# EAGLE design schematic (EAGLE 8.3.0)
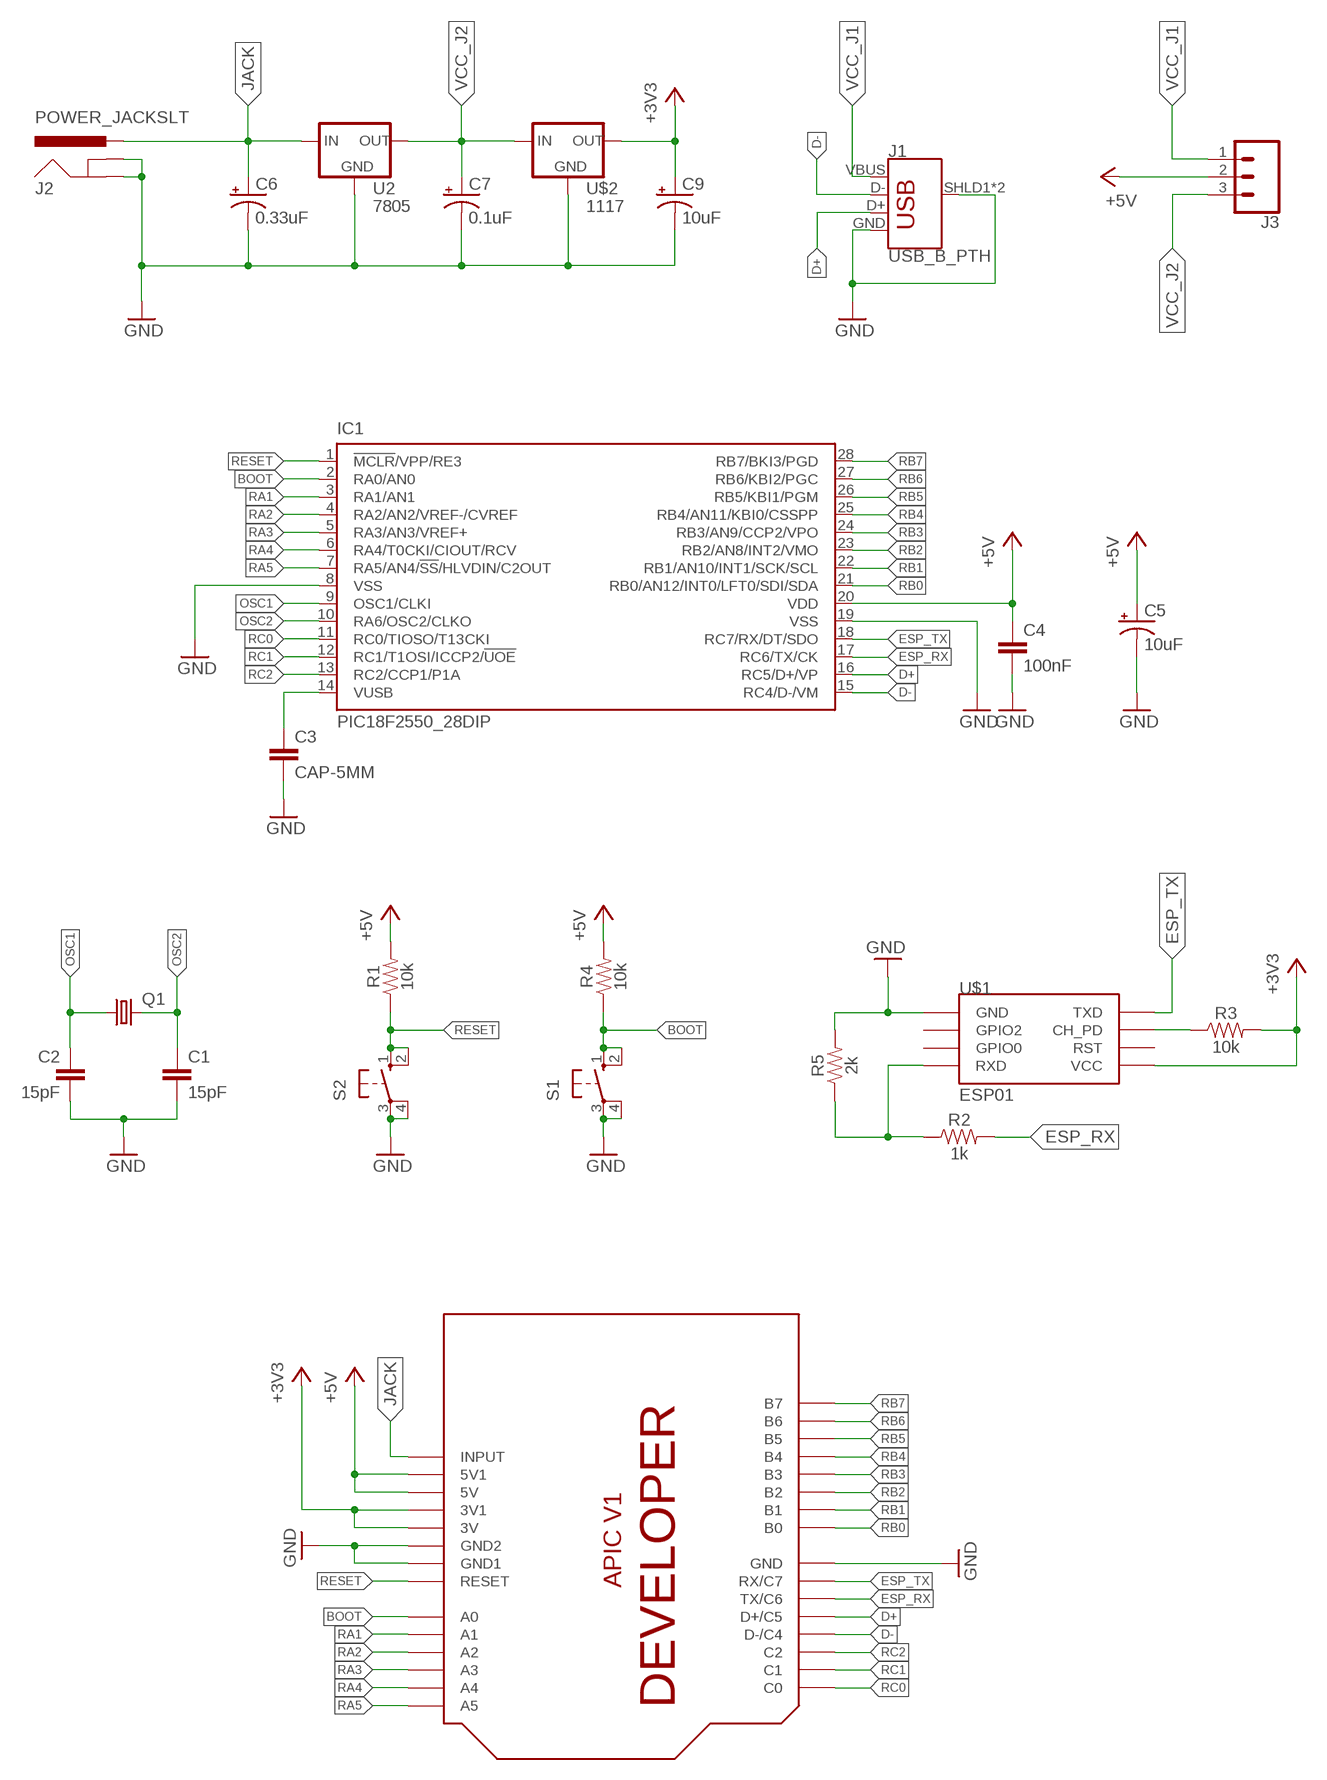
[diagram p0: schematic, sheet 1]

## Parts
C1  15pF  0.1UF-KIT-EZ-50V-20%  [CAP-PTH-SMALL-KIT]
C2  15pF  0.1UF-KIT-EZ-50V-20%  [CAP-PTH-SMALL-KIT]
C3  CAP-5MM  [CAP-PTH-5MM]
C4  100nF  0.1UF-KIT-EZ-50V-20%  [CAP-PTH-SMALL-KIT]
C5  10uF  10UF-POLAR-RADIAL-2.5MM-25V-20%  [CPOL-RADIAL-2.5MM-5MM]
C6  0.33uF  10UF-POLAR-RADIAL-2.5MM-25V-20%  [CPOL-RADIAL-2.5MM-5MM]
C7  0.1uF  10UF-POLAR-RADIAL-2.5MM-25V-20%  [CPOL-RADIAL-2.5MM-5MM]
C9  10uF  10UF-POLAR-RADIAL-2.5MM-25V-20%  [CPOL-RADIAL-2.5MM-5MM]
IC1  PIC18F2550_28DIP  [DIL28-3]
J1  USB_B_PTH  [USB-B-PTH]
J2  POWER_JACKSLT  [POWER_JACK_SLOT]
J3  CONN_03LOCK_LONGPADS  [1X03_LOCK_LONGPADS]
Q1  CRYSTAL  [HC49U70]
R1  10k  10KOHM-HORIZ-1/4W-1%  [AXIAL-0.3]
R2  1k  10KOHM-HORIZ-1/4W-1%  [AXIAL-0.3]
R3  10k  10KOHM-HORIZ-1/4W-1%  [AXIAL-0.3]
R4  10k  10KOHM-HORIZ-1/4W-1%  [AXIAL-0.3]
R5  2k  10KOHM-HORIZ-1/4W-1%  [AXIAL-0.3]
S1  10-XX  [B3F-10XX]
S2  10-XX  [B3F-10XX]
U1  APIC-BPLACE  [APIC]
U2  7805  V_REG_78XXSIDE  [78XXL]
U$1  ESP01  [ESP01]
U$2  1117  V_REG_LD1117VXX  [78XXL]

## Nets
+3V3: C9.1(+) R3.P$2 U1.3V U1.3V1 U$1.VCC U$2.GND(OUT)
+5V: C4.1 C5.1(+) IC1.20(VDD) J3.2 R1.P$2 R4.P$2 U1.5V U1.5V1
BOOT: IC1.2(RA0/AN0) R4.P$1 S1.1(S) S1.2(S1) U1.A0
D+: IC1.16(RC5/D+/VP) J1.D+ U1.C5(D+/C5)
D-: IC1.15(RC4/D-/VM) J1.D- U1.C4(D-/C4)
ESP_RX: IC1.17(RC6/TX/CK) R2.P$2 U1.C6(TX/C6)
ESP_TX: IC1.18(RC7/RX/DT/SDO) U1.C7(RX/C7) U$1.TX(TXD)
GND: C1.2 C2.2 C3.2 C4.2 C5.2(-) C6.2(-) C7.2(-) C9.2(-) IC1.8(VSS) IC1.19(VSS) J1.GND J1.SHLD1(SHIELD) J1.SHLD2(SHIELD) J2.GND@1(GNDBREAK) J2.GND@2(GND) R5.P$2 S1.3(P) S1.4(P1) S2.3(P) S2.4(P1) U1.GND U1.GND1 U1.GND2 U2.GND U$1.GND U$2.IN(GND)
JACK: C6.1(+) J2.PWR U1.INPUT U2.IN
N$1: R3.P$1 U$1.CH_PD
N$6: R2.P$1 R5.P$1 U$1.RX(RXD)
N$11: C3.1 IC1.14(VUSB)
OSC1: C2.1 IC1.9(OSC1/CLKI) Q1.1
OSC2: C1.1 IC1.10(RA6/OSC2/CLKO) Q1.2
RA1: IC1.3(RA1/AN1) U1.A1
RA2: IC1.4(RA2/AN2/VREF-/CVREF) U1.A2
RA3: IC1.5(RA3/AN3/VREF+) U1.A3
RA4: IC1.6(RA4/T0CKI/CIOUT/RCV) U1.A4
RA5: IC1.7(RA5/AN4/!SS!/HLVDIN/C2OUT) U1.A5
RB0: IC1.21(RB0/AN12/INT0/LFT0/SDI/SDA) U1.B0
RB1: IC1.22(RB1/AN10/INT1/SCK/SCL) U1.B1
RB2: IC1.23(RB2/AN8/INT2/VMO) U1.B2
RB3: IC1.24(RB3/AN9/CCP2/VPO) U1.B3
RB4: IC1.25(RB4/AN11/KBI0/CSSPP) U1.B4
RB5: IC1.26(RB5/KBI1/PGM) U1.B5
RB6: IC1.27(RB6/KBI2/PGC) U1.B6
RB7: IC1.28(RB7/BKI3/PGD) U1.B7
RC0: IC1.11(RC0/TIOSO/T13CKI) U1.C0
RC1: IC1.12(RC1/T1OSI/ICCP2/!UOE) U1.C1
RC2: IC1.13(RC2/CCP1/P1A) U1.C2
RESET: IC1.1(!MCLR!/VPP/RE3) R1.P$1 S2.1(S) S2.2(S1) U1.RESET
VCC_J1: J1.VBUS J3.1
VCC_J2: C7.1(+) J3.3 U2.OUT U$2.OUT(IN)
Unconnected: U$1.GPIO0 U$1.GPIO2 U$1.RST

## Library data of the parts
C1 C2 C4 = SparkFun-Capacitors:0.1UF: 0.1µF ceramic capacitors A capacitor is a passive two-terminal electrical component used to store electrical energy temporarily in an electric field.; PROD_ID: CAP-08370; VALUE: 0.1uF
C3 = 1AugustoLib:CAP-5MM
C5 C9 = SparkFun-Capacitors:10UF-POLAR: 10.0µF polarized capacitors A capacitor is a passive two-terminal electrical component used to store electrical energy temporarily in an electric field.; PROD_ID: CAP-08440
C6 C7 = SparkFun-Capacitors:10UF-POLAR: 10.0µF polarized capacitors A capacitor is a passive two-terminal electrical component used to store electrical energy temporarily in an electric field.; PROD_ID: CAP-08440; VALUE: 10uF
IC1 = microchip:PIC18F2*_28: USB Microcontrollers with nanoWatt Technology High-Performance, Enhanced Flash, 28/40/44-Pin, Source: http://ww1.microchip.com/downloads/en/devicedoc/39632c.pdf; MF: MICROCHIP; MPN: PIC18F2550-I/SP; OC_FARNELL: 1523822; OC_NEWARK: 80K6054
J1 = 1AugustoLib:USB_B: USB Type B Connector SparkFun Products: SparkFun Stepoko <https://www.sparkfun.com/products/13899> PTH; PROD_ID: CONN-08278; SF_ID: PRT-00139
J2 = SparkFun-Connectors:POWER_JACK: Power Jack Connector This is the standard 5.5mm barrel jack for power. The PTH is the most common, proven, reliable, footprint. The Slot footprint only works if the mill layer is transmitted to the PCB fab house so be warned. Here are the connectors we sell at SparkFun: DC Barrel Power Jack/Connector <https://www.sparkfun.com/products/119> (PRT-00119) DC Barrel Power Jack/Connector (SMD) <https://www.sparkfun.com/products/12748> (PRT-12748) DC Barrel Jack Adapter - Breadboard Compatible <https://www.sparkfun.com/products/10811> (PRT-10811) It is used on this SparkFun product (and many, many others): SparkFun RedBoard - Programmed with Arduino <https://www.sparkfun.com/products/12757> (DEV-12757) Also, if you need a mating power supply or connector, please check these out: Wall Adapter Power Supply - 9VDC 650mA <https://www.sparkfun.com/products/298> (TOL-00298) DC Barrel Jack Adapter - Male <https://www.sparkfun.com/products/10287> (PRT-10287); PROD_ID: PRT-00119
J3 = SparkFun-Connectors:CONN_03: Multi connection point. Often used as Generic Header-pin footprint for 0.1 inch spaced/style header connections On any of the 0.1 inch spaced packages, you can populate with these: Break Away Headers - Straight <https://www.sparkfun.com/products/116> (PRT-00116) Break Away Male Headers - Right Angle <https://www.sparkfun.com/products/553> (PRT-00553) Female Headers <https://www.sparkfun.com/products/115> (PRT-00115) Break Away Headers - Machine Pin <https://www.sparkfun.com/products/117> (PRT-00117) Break Away Female Headers - Swiss Machine Pin <https://www.sparkfun.com/products/743> (PRT-00743) Stackable Header - 3 Pin (Female, 0.1") <https://www.sparkfun.com/products/13875> (PRT-13875) For SCREWTERMINALS and SPRING TERMINALS visit here: Screw Terimnals on SparkFun.com <https://www.sparkfun.com/search/results?term=Screw+Terminals> (5mm/3.5mm/2.54mm spacing) This device is also useful as a general connection point to wire up your design to another part of your project. Our various solder wires solder well into these plated through hole pads. Hook-Up Wire - Assortment (Stranded, 22 AWG) <https://www.sparkfun.com/products/11375> (PRT-11375) Hook-Up Wire - Assortment (Solid Core, 22 AWG) <https://www.sparkfun.com/products/11367> (PRT-11367) View the entire wire category on our website here <https://www.sparkfun.com/categories/141> Special notes: Molex polarized connector foot print use with SKU : PRT-08232 with associated crimp pins and housings.
Q1 = 1AugustoLib:CRYSTAL
R1 R3 R4 = SparkFun-Resistors:10KOHM: 10kΩ resistor A resistor is a passive two-terminal electrical component that implements electrical resistance as a circuit element. Resistors act to reduce current flow, and, at the same time, act to lower voltage levels within circuits. - Wikipedia; PROD_ID: RES-12183
R2 R5 = SparkFun-Resistors:10KOHM: 10kΩ resistor A resistor is a passive two-terminal electrical component that implements electrical resistance as a circuit element. Resistors act to reduce current flow, and, at the same time, act to lower voltage levels within circuits. - Wikipedia; PROD_ID: RES-12183; VALUE: 10k
S1 S2 = switch-omron:10-XX: OMRON SWITCH; MPN: B3F-1000; OC_FARNELL: 176432; OC_NEWARK: 36M3542
U1 = 1AugustoLib:APIC: This is a new object for the new Arduino R3 - with extra pins that you may want to use (such as IOref, and duplicated A4/A5
U2 = 1AugustoLib:V_REG_78XX: Voltage Regulator Standard 78xx regulator. IGO (Input Ground Output). Spark Fun Electronics SKU : COM-00107
U$1 = 1AugustoLib:ESP01: ESP8266 Wifi module 01
U$2 = 1AugustoLib:V_REG_LD1117VXX: LD1117VXX voltage regulator. We carry the 3.3V version (COM-00526) in TO-220 package.

## Board
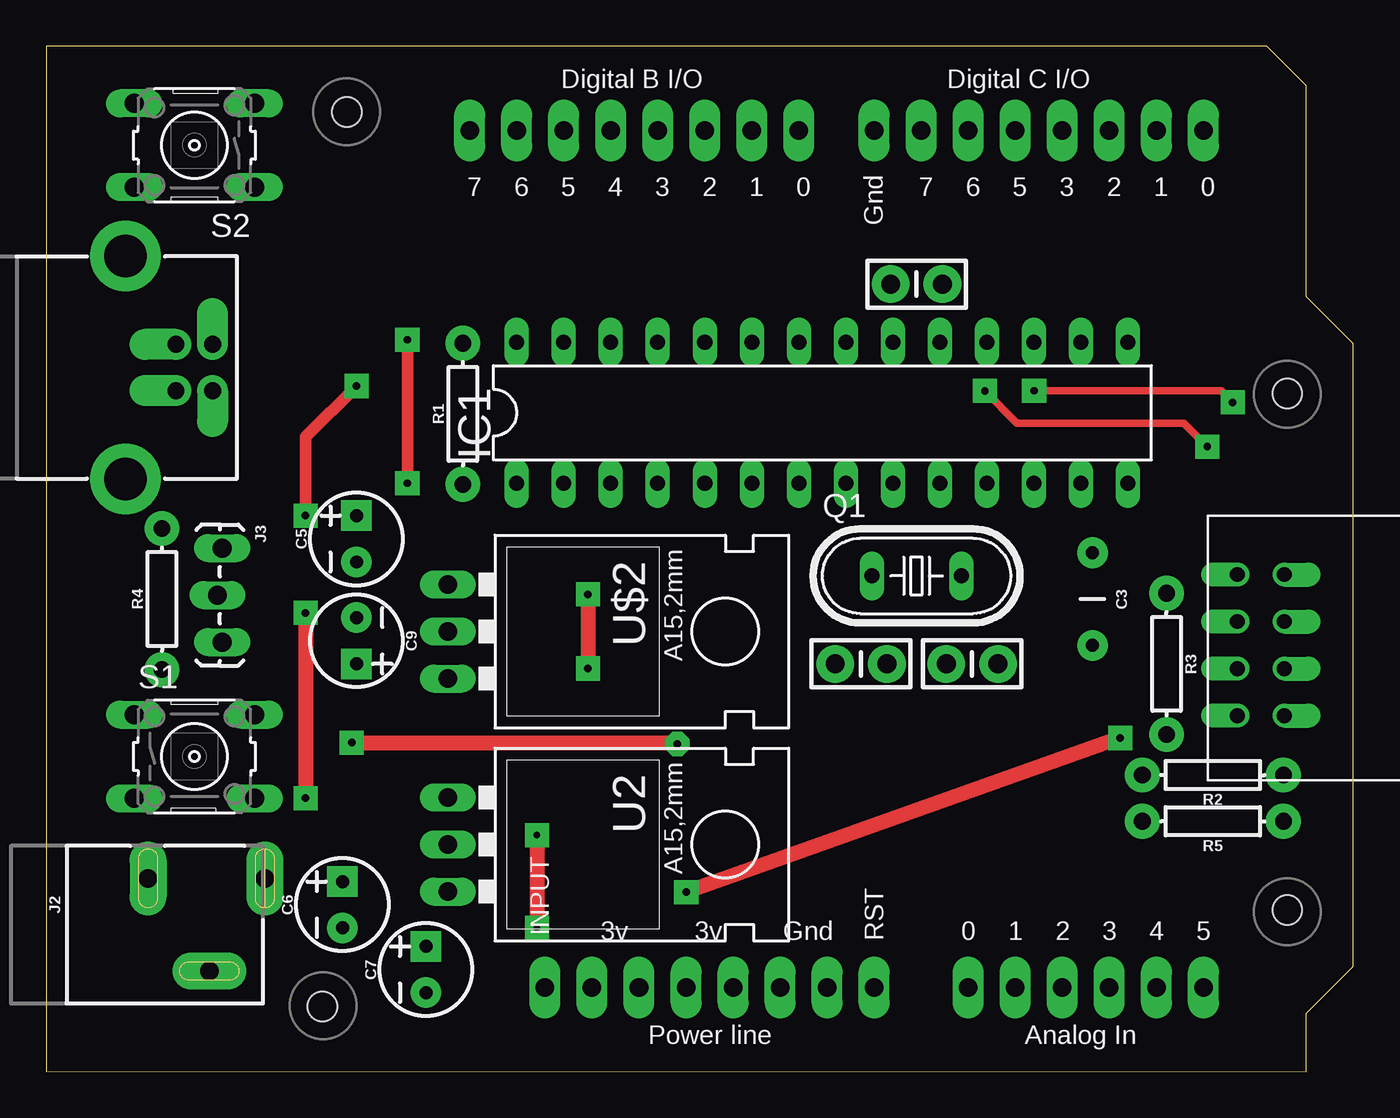
[diagram p1: board, top side]
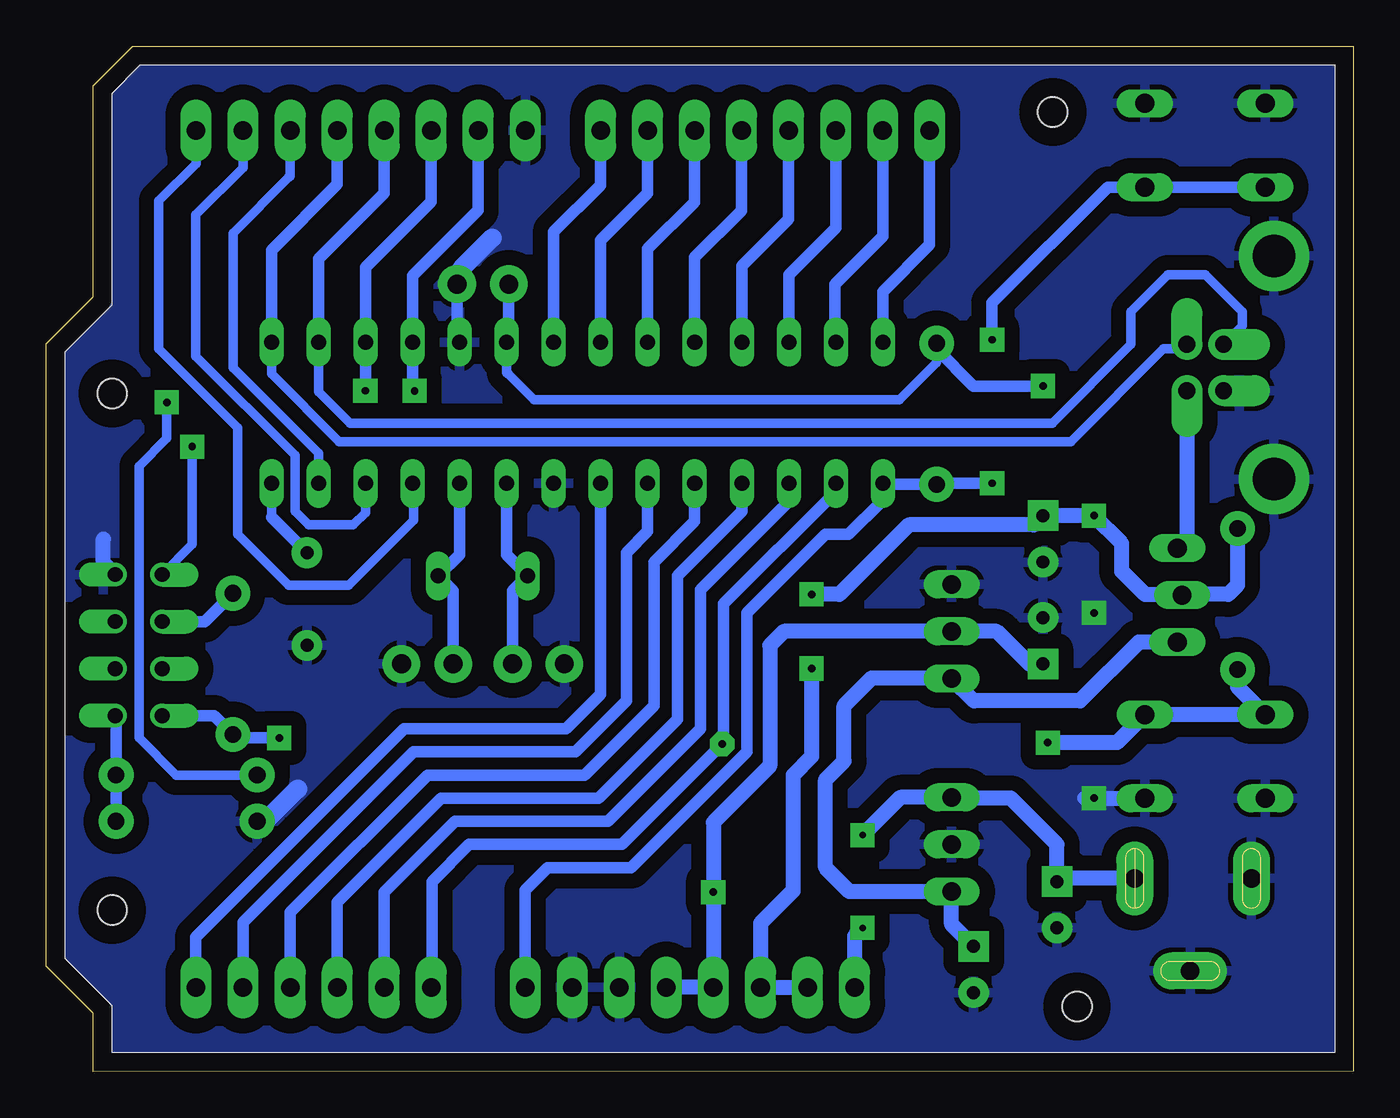
[diagram p2: board, bottom side, seen from below]

Size 70.58 x 55.35 mm. Coordinates in mm from the lower left corner, seen from the top.
Outline: 0,0.01 68.05,0 68.05,3.16 70.58,5.69 70.58,39.29 68.04,41.83 68.04,53.23 65.92,55.35 0,55.35 0,0.01
Copper layers (1*16): Top 0.035mm / dielectric 1.5mm / Bottom 0.035mm
Design rules "default": minimum track width 6mil, minimum drill 0.35mm, track to track 6mil, track to pad 6mil, pad to pad 6mil, via to via 6mil, smd to smd 6mil, copper to edge 40mil, drill to drill 6mil, minimum pad ring 10mil, minimum via ring 8mil, stop-mask expansion 4mil, vias tented up to drill 0mil, thermal gap 10mil
Holes 1.6 mm at 16.22,51.81 67.02,36.61 67.02,8.71 14.92,3.51

### Footprints (pad centres in the part's own frame; a part is rotated, then mirrored left to right if it is on the bottom)
CAP-PTH-SMALL-KIT = drill 1.016 pad 2.032: 1 -1.397,0; 2 1.397,0
CAP-PTH-5MM = drill 0.7 pad 1.651: 1 -2.5,0; 2 2.5,0
CPOL-RADIAL-2.5MM-5MM = drill 0.7 pad 1.651 square: 1 1.25,0 | drill 0.7 pad 1.651: 2 -1.25,0
DIL28-3 = drill 0.813 long: 1 -16.51,-3.81; 2 -13.97,-3.81; 3 -11.43,-3.81; 4 -8.89,-3.81; 5 -6.35,-3.81; 6 -3.81,-3.81; 7 -1.27,-3.81; 8 1.27,-3.81; 9 3.81,-3.81; 10 6.35,-3.81; 11 8.89,-3.81; 12 11.43,-3.81; 13 13.97,-3.81; 14 16.51,-3.81; 15 16.51,3.81; 16 13.97,3.81; 17 11.43,3.81; 18 8.89,3.81; 19 6.35,3.81; 20 3.81,3.81; 21 1.27,3.81; 22 -1.27,3.81; 23 -3.81,3.81; 24 -6.35,3.81; 25 -8.89,3.81; 26 -11.43,3.81; 27 -13.97,3.81; 28 -16.51,3.81
USB-B-PTH = drill 0.914 pad 1.676 offset: D+ 4,1.25; D- 5.981,1.25; GND 4,-1.25; VBUS 5.981,-1.25 | drill 2.286 pad 3.81: SHLD1 1.282,-6.02; SHLD2 1.282,6.02
POWER_JACK_SLOT = drill 1 pad 2 long: GND@1 2.58,7.5; GND@2 7.58,10.8; PWR 2.58,13.8
1X03_LOCK_LONGPADS = drill 1.016 long: 1 0,0; 2 2.54,-0.254; 3 5.08,0
HC49U70 = drill 0.813 long: 1 -2.413,0; 2 2.413,0
AXIAL-0.3 = drill 0.9 pad 1.88: P$1 -3.81,0; P$2 3.81,0
B3F-10XX = drill 1.016 long: 1 -3.251,2.261; 2 3.251,2.261; 3 -3.251,-2.261; 4 3.251,-2.261
APIC = drill 1 pad 1.676 long: 3V 36.1,3.54; 3V1 33.56,3.54; 5V 31.02,3.54; 5V1 28.48,3.54; A0 48.8,3.54; A1 51.34,3.54; A2 53.88,3.54; A3 56.42,3.54; A4 58.96,3.54; A5 61.5,3.54; B0 39.656,49.8; B1 37.116,49.8; B2 34.576,49.8; B3 32.036,49.8; B4 29.496,49.8; B5 26.956,49.8; B6 24.416,49.8; B7 21.876,49.8; C0 61.5,49.8; C1 58.96,49.8; C2 56.42,49.8; C4 53.88,49.8; C5 51.34,49.8; C6 48.8,49.8; C7 46.26,49.8; GND 43.72,49.8; GND1 41.18,3.54; GND2 38.64,3.54; INPUT 25.94,3.54; RESET 43.72,3.54
78XXL = drill 1.016 long: GND 0,-3.81; IN -2.54,-3.81; OUT 2.54,-3.81
ESP01 = drill 0.8 offset: CH_PD -1.285,-8.178; GND -3.825,-5.638; GPIO0 1.255,-5.638; GPIO2 -1.285,-5.638; RST 1.255,-8.178; RX 3.795,-5.638; TX -3.825,-8.178; VCC 3.795,-8.178

### Placement (x,y rotation side)
C1  50,22.01 0 top
C2  44,22.01 180 top
C3  56.5,25.51 270 top
C4  47,42.51 0 top
C5  16.75,28.76 90 top
C6  16,9.01 90 top
C7  20.5,5.51 90 top
C9  16.75,23.26 270 top
IC1  41.91,35.57 0 top
J1  3,38.01 0 top
J2  -2,13.01 270 top
J3  9.5,28.26 270 top
Q1  47,26.76 0 top
R1  22.5,35.51 90 top
R2  63,16.01 180 top
R3  60.5,22.01 270 top
R4  6.25,25.51 90 top
R5  63,13.51 180 top
S1  8,17.01 0 top
S2  8,50.01 180 top
U1  0.99,1.01 0 top
U2  25.5,12.26 270 top
U$1  72.5,23.01 270 top
U$2  25.5,23.76 270 top

### Tracks (layer width: path | path; a pad name or v marks a point on that pad's centre or on a via)
+3V3  (via drill 0.4 pad 1.3)
  Top 0.813: v58,18.01 v34.56,9.69
  Bottom 0.61: U$1.VCC 61.52,19.21 R3.P$2 60.19,18.01 v58,18.01
  Bottom 0.813: C9.1 17.5,22.01 19.25,23.76 U$2.GND 30.75,23.76 31.5,23.01 31.5,16.51 34.56,13.45 v34.56,9.69 U1.3V1 U1.3V
+5V  (via drill 0.4 pad 1.3)
  Top 0.61: v16.75,37.01 14,34.26 v14,30.01
  Top 0.813: v29.25,25.76 v29.25,21.76
  Bottom 0.406: 45.72,37.73 45.62,37.63
  Bottom 0.508: IC1.20 45.72,37.73 | 45.62,37.63 44.25,36.26 24.5,36.26 22.5,38.26 R1.P$2
  Bottom 0.61: IC1.20 45.6,39.5 C4.1 | R1.P$2 22.5,39.01 20.5,37.01 v16.75,37.01 | 29.48,21.53 v29.25,21.76
  Bottom 0.813: R4.P$2 6.25,26.26 6.75,25.76 9.21,25.76 J3.2 9.29,25.76 11.25,25.76 12.5,27.01 12.5,28.51 v14,30.01 C5.1 17.25,29.51 24,29.51 27.75,25.76 v29.25,25.76 | v29.25,21.76 29.25,17.01 30.25,16.01 30.25,9.76 32,8.01 U1.5V U1.5V1 29.5,4.58
BOOT  (via drill 0.4 pad 1.3)
  Top 0.813: v16.5,17.76 34,17.76 v34.08,17.69
  Bottom 0.61: IC1.2 28,31.7 28,31.26 34,25.26 34,17.76 v34.08,17.69 39.5,12.26 47.75,12.26 49.75,10.26 49.75,4.59 U1.A0
  Bottom 0.813: R4.P$1 6.25,20.77 S1.1 S1.2 12.76,17.76 v16.5,17.76
D+
  Bottom 0.508: J1.D+ 6,40.26 6,41.01 8,43.01 10,43.01 12,41.01 12,39.26 16.25,35.01 54.18,35.01 55.88,36.71 IC1.16
  Bottom 0.61: IC1.16 55.88,43.88 52.33,47.43 U1.C5
D-
  Bottom 0.508: IC1.15 58.42,37.67 54.76,34.01 15.25,34.01 10.25,39.01 9.23,39.01 J1.D-
  Bottom 0.61: IC1.15 58.42,44.34 54.87,47.89 U1.C4
ESP_RX  (via drill 0.4 pad 1.3)
  Top 0.406: v64.07,36.13 63.45,36.75 v53.35,36.75
  Bottom 0.508: R2.P$2 63.57,16.01 65.57,18.01 65.57,32.69 64.07,34.19 v64.07,36.13
  Bottom 0.61: v53.35,36.75 53.34,36.77 IC1.17 53.34,43.42 49.79,46.97 U1.C6
ESP_TX  (via drill 0.4 pad 1.3)
  Top 0.406: v62.7,33.74 61.43,35.01 52.43,35.01 v50.69,36.75
  Bottom 0.508: U$1.TX 62.7,28.46 v62.7,33.74
  Bottom 0.61: 47.31,46.45 47.26,46.5 | 47.31,46.45 50.8,42.96 IC1.18 50.8,36.86 v50.69,36.75 | U1.C7 47.25,46.51 47.31,46.45
GND  (via drill 0.4 pad 1.3)
  Top 0.813: v14,24.76 v14,14.76
  Bottom 0.61: IC1.19 48.4,39.52 C4.2
  Bottom 0.813: 14.49,14.75 14.5,14.76 | U$1.GND 67.5,27.47 67.5,28.76 | v14,14.76 v13.99,14.75 S1.4
  Bottom 1.016: C4.2 48.15,43.36 46.5,45.01 | R5.P$2 58.75,13.51 57,15.26
  pour Bottom (isolate 0.813): -1,57.01 -1,-1.99 72,-1.99 72,57.01
JACK  (via drill 0.35 pad 1.3)
  Top 0.813: v26.5,12.76 v26.5,7.76
  Bottom 0.813: J2.PWR 15.83,10.43 C6.1 16,12.26 18.5,14.76 21.65,14.76 U2.IN 24.46,14.8 v26.5,12.76 | v26.5,7.76 26.93,7.33 U1.INPUT
N$1
  Bottom 0.61: R3.P$1 62.02,24.3 U$1.CH_PD
N$6
  Bottom 0.61: R5.P$1 R2.P$1 66.81,19.16 U$1.RX
N$11
  Bottom 0.508: 58.42,29.93 IC1.14
  Bottom 0.61: C3.1 58.42,29.93
OSC1
  Bottom 0.61: IC1.9 45.72,27.89 Q1.1 45.4,25.95 C2.1
OSC2
  Bottom 0.61: IC1.10 48.26,27.91 Q1.2 48.6,25.95 C1.1
RA1
  Bottom 0.61: IC1.3 30.48,30.78 35.25,26.01 35.25,18.51 40.25,13.51 48.5,13.51 52.34,9.67 U1.A1
RA2
  Bottom 0.61: IC1.4 33.02,30.24 36.5,26.76 36.5,19.01 40.75,14.76 49.25,14.76 54.88,9.13 U1.A2
RA3
  Bottom 0.61: IC1.5 35.56,29.7 37.75,27.51 37.75,19.76 41.5,16.01 50,16.01 57.42,8.59 U1.A3
RA4
  Bottom 0.61: IC1.6 38.1,29.16 39.25,28.01 39.25,20.01 42,17.26 50.75,17.26 59.96,8.05 U1.A4
RA5
  Bottom 0.61: IC1.7 40.64,20.37 42.5,18.51 51.25,18.51 62.5,7.26 U1.A5
RB0
  Bottom 0.61: IC1.21 43.18,45.33 40.66,47.85 U1.B0
RB1
  Bottom 0.61: IC1.22 40.64,44.87 38.11,47.4 U1.B1
RB2
  Bottom 0.61: IC1.23 38.1,44.41 35.57,46.94 U1.B2
RB3
  Bottom 0.61: IC1.24 35.56,43.95 33.03,46.48 U1.B3
RB4
  Bottom 0.61: IC1.25 33.02,43.49 30.49,46.02 U1.B4
RB5
  Bottom 0.61: IC1.26 30.48,43.03 27.95,45.56 U1.B5
RB6
  Bottom 0.61: IC1.27 28,39.44 28,42.51 25.41,45.1 U1.B6
RB7
  Bottom 0.61: IC1.28 25.4,42.11 22.88,44.63 U1.B7
RC0
  Bottom 0.406: 50.8,31.39 IC1.11 | 50.8,31.39 50.8,31.21 | 50.75,31.34 50.8,31.39
  Bottom 0.508: 50.75,31.34 50.75,29.76 54.25,26.26 57.5,26.26 60.25,29.01 60.25,29.66 60.25,29.93 60.25,34.76 64.5,39.01 64.5,47.01 62.49,49.02 U1.C0
RC1
  Bottom 0.406: 53.34,30.67 IC1.12
  Bottom 0.508: IC1.12 53.34,30.17 54,29.51 56.4,29.51 57.15,30.26 57.15,33.26 62.5,38.61 62.5,46.26 59.96,48.8 59.95,48.81 U1.C1
RC2
  Bottom 0.508: 57.51,48.25 60.5,45.26 60.5,38.01 55.88,33.39 IC1.13 | 57.51,48.25 57.42,48.34 | U1.C2 57.41,48.35 57.51,48.25
RESET  (via drill 0.4 pad 1.3)
  Top 0.61: v19.5,39.51 v19.5,31.76
  Bottom 0.61: S2.2 S2.1 13.26,47.75 19.5,41.51 v19.5,39.51 | 25.46,31.7 IC1.1 | v19.5,31.76 22.44,31.76 R1.P$1 25.46,31.7 | 25.46,31.7 25.5,31.66 | U1.RESET 44.72,9.79 43.5,11.01 39,11.01 32.75,17.26 32.75,24.76 28.5,29.01 27.25,29.01 25.46,30.8 25.46,31.7
VCC_J1
  Bottom 0.813: J1.VBUS 8.98,28.78 J3.1
VCC_J2
  Bottom 0.813: U2.OUT 21.69,7.95 C7.1 | J3.3 11.58,23.18 14.75,20.01 20.48,20.01 U$2.OUT 21.73,21.26 26,21.26 27.5,19.76 27.5,16.76 28.5,15.76 28.5,11.01 27.21,9.72 U2.OUT | 21.73,9.76 U2.OUT